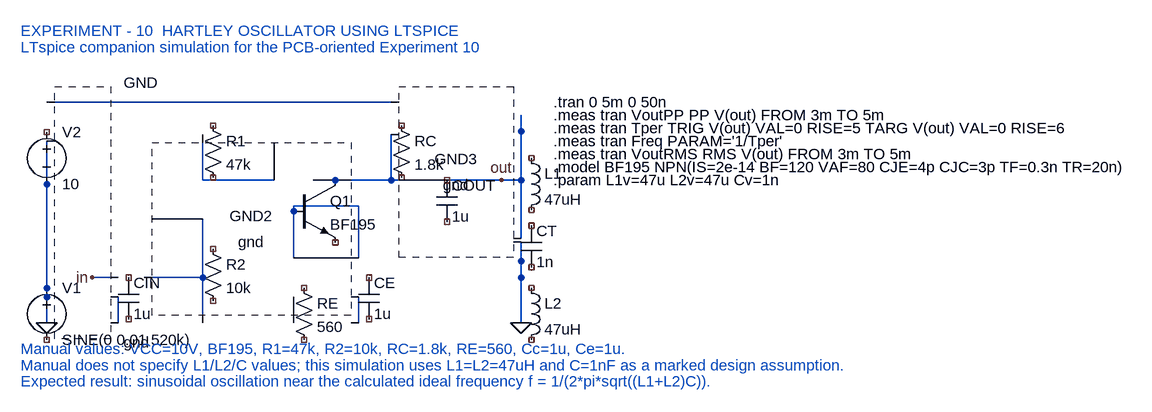
[diagram p0: schematic ECA0410_LTSpice_Hartley_Oscillator.asc]
ECA0410_LTSpice_Hartley_Oscillator.asc, the LTspice schematic file:
Version 4
SHEET 1 1200 800
FLAG 190 500 in
FLAG 820 350 out
FLAG 120 570 0
FLAG 850 570 0
SYMBOL voltage 120 260 R0
SYMATTR InstName V2
SYMATTR Value 10
SYMBOL voltage 120 500 R0
SYMATTR InstName V1
SYMATTR Value SINE(0 0.01 520k)
SYMATTR SpiceLine AC 1
SYMBOL npn 500 350 R0
SYMATTR InstName Q1
SYMATTR Value BF195
SYMBOL res 360 250 R0
SYMATTR InstName R1
SYMATTR Value 47k
SYMBOL res 360 440 R0
SYMATTR InstName R2
SYMATTR Value 10k
SYMBOL res 650 250 R0
SYMATTR InstName RC
SYMATTR Value 1.8k
SYMBOL res 500 500 R0
SYMATTR InstName RE
SYMATTR Value 560
SYMBOL cap 230 500 R0
SYMATTR InstName CIN
SYMATTR Value 1u
SYMBOL cap 720 350 R0
SYMATTR InstName COUT
SYMATTR Value 1u
SYMBOL cap 600 500 R0
SYMATTR InstName CE
SYMATTR Value 1u
SYMBOL cap 850 420 R0
SYMATTR InstName CT
SYMATTR Value 1n
SYMBOL ind 850 300 R0
SYMATTR InstName L1
SYMATTR Value 47uH
SYMBOL ind 850 500 R0
SYMATTR InstName L2
SYMATTR Value 47uH
SYMBOL gnd 120 570 R0
SYMATTR InstName GND
WIRE 120 230 650 230
WIRE 120 290 120 570
WIRE 120 530 120 570
WIRE 360 280 360 350
WIRE 360 350 470 350
WIRE 360 410 360 570
WIRE 500 390 500 470
WIRE 500 530 500 570
WIRE 530 350 650 350
WIRE 650 280 650 350
WIRE 650 350 700 350
WIRE 740 350 820 350
WIRE 820 350 850 350
WIRE 850 325 850 350
WIRE 850 350 850 395
WIRE 850 445 850 475
WIRE 850 475 850 500
WIRE 850 325 850 250
WIRE 850 250 850 275
WIRE 850 475 850 525
WIRE 850 525 850 570
WIRE 850 440 850 395
WIRE 230 530 230 570
WIRE 190 500 230 500
WIRE 270 500 360 500
WIRE 600 530 600 570
WIRE 600 470 600 390
WIRE 600 390 500 390
SYMBOL gnd 360 570 R0
SYMATTR InstName GND2
SYMBOL gnd 850 570 R0
SYMATTR InstName GND3
TEXT 80 120 Left 2 EXPERIMENT - 10  HARTLEY OSCILLATOR USING LTSPICE
TEXT 80 145 Left 2 LTspice companion simulation for the PCB-oriented Experiment 10
TEXT 80 610 Left 2 Manual values: VCC=10V, BF195, R1=47k, R2=10k, RC=1.8k, RE=560, Cc=1u, Ce=1u.
TEXT 80 635 Left 2 Manual does not specify L1/L2/C values; this simulation uses L1=L2=47uH and C=1nF as a marked design assumption.
TEXT 80 660 Left 2 Expected result: sinusoidal oscillation near the calculated ideal frequency f = 1/(2*pi*sqrt((L1+L2)C)).
TEXT 900 230 Left 2 !.tran 0 5m 0 50n
TEXT 900 250 Left 2 !.meas tran VoutPP PP V(out) FROM 3m TO 5m
TEXT 900 270 Left 2 !.meas tran Tper TRIG V(out) VAL=0 RISE=5 TARG V(out) VAL=0 RISE=6
TEXT 900 290 Left 2 !.meas tran Freq PARAM='1/Tper'
TEXT 900 310 Left 2 !.meas tran VoutRMS RMS V(out) FROM 3m TO 5m
TEXT 900 330 Left 2 !.model BF195 NPN(IS=2e-14 BF=120 VAF=80 CJE=4p CJC=3p TF=0.3n TR=20n)
TEXT 900 350 Left 2 !.param L1v=47u L2v=47u Cv=1n

The netlist it stands for:
* ECA0410_LTSpice_Hartley_Oscillator.asc
V2 NC_01 0 10
V1 0 NC_02 SINE(0 0.01 520k) AC 1
Q1 N006 N004 NC_03 0 BF195
R1 NC_04 NC_05 47k
R2 NC_06 NC_07 10k
RC NC_08 NC_09 1.8k
RE NC_10 NC_11 560
CIN NC_12 NC_13 1u
COUT NC_14 NC_15 1u
CE NC_16 NC_17 1u
CT NC_18 NC_19 1n
L1 NC_20 NC_21 47uH
L2 NC_22 NC_23 47uH
* GND: gnd (symbol gnd not available, pin order unknown); nets seen at it: 0, in, N001, N007
* GND2: gnd (symbol gnd not available, pin order unknown); nets seen at it: N002, N003, N004, N005, N006, N008
* GND3: gnd (symbol gnd not available, pin order unknown); nets seen at it: 0, N001, N006, out
.model NPN NPN
.model PNP PNP
.lib standard.bjt
* EXPERIMENT - 10  HARTLEY OSCILLATOR USING LTSPICE
* LTspice companion simulation for the PCB-oriented Experiment 10
* Manual values: VCC=10V, BF195, R1=47k, R2=10k, RC=1.8k, RE=560, Cc=1u, Ce=1u.
* Manual does not specify L1/L2/C values; this simulation uses L1=L2=47uH and C=1nF as a marked design assumption.
* Expected result: sinusoidal oscillation near the calculated ideal frequency f = 1/(2*pi*sqrt((L1+L2)C)).
.tran 0 5m 0 50n
.meas tran VoutPP PP V(out) FROM 3m TO 5m
.meas tran Tper TRIG V(out) VAL=0 RISE=5 TARG V(out) VAL=0 RISE=6
.meas tran Freq PARAM='1/Tper'
.meas tran VoutRMS RMS V(out) FROM 3m TO 5m
.model BF195 NPN(IS=2e-14 BF=120 VAF=80 CJE=4p CJC=3p TF=0.3n TR=20n)
.param L1v=47u L2v=47u Cv=1n
.backanno
.end